# EAGLE schematic RPiSoC_Shield (EAGLE 7.1.0)
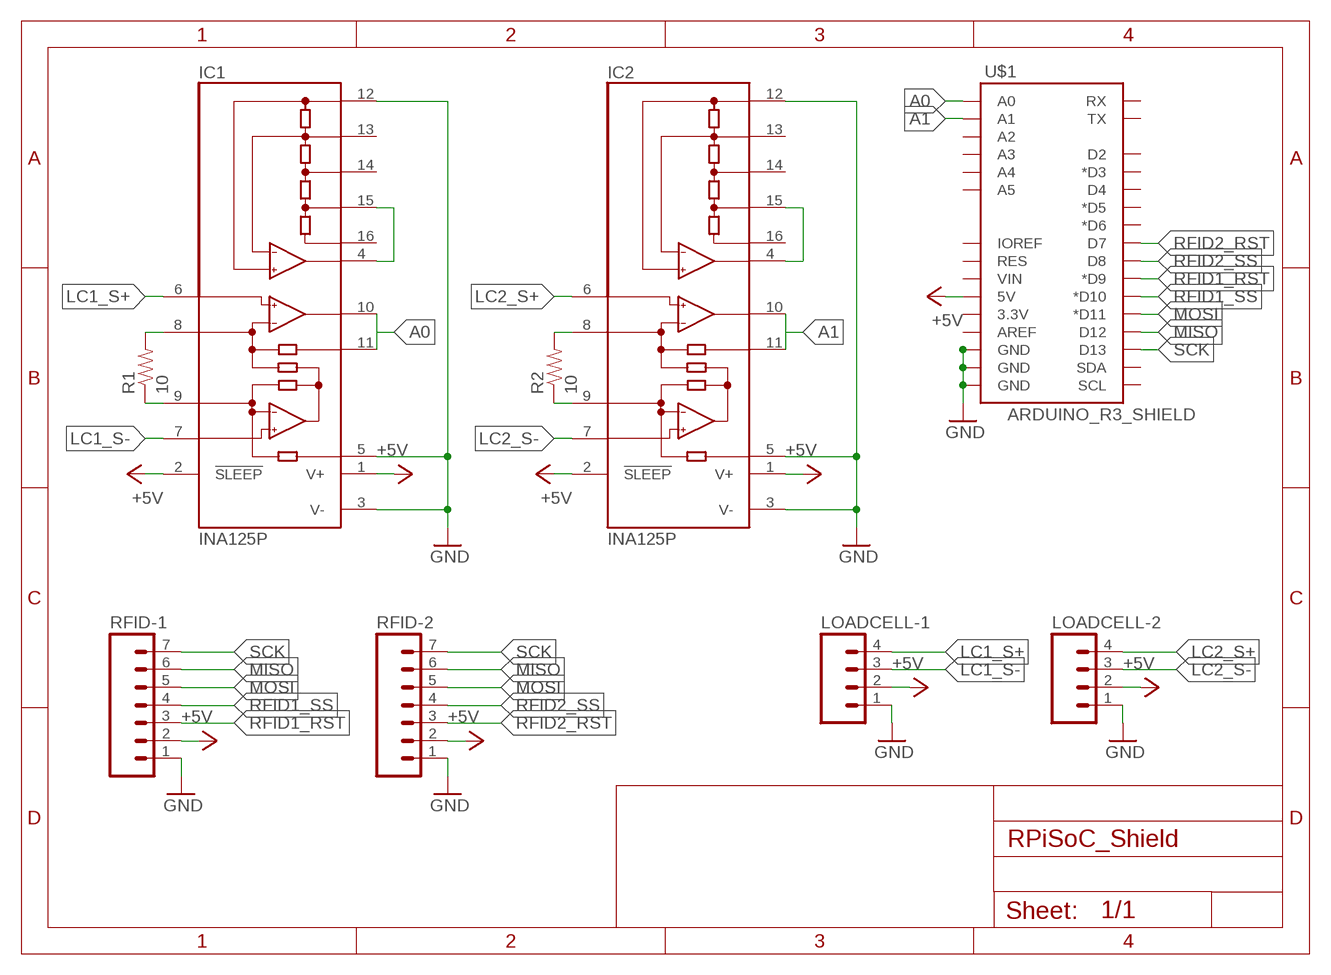
[diagram p0: schematic, sheet 1]
FRAME2 (DINA5_L): CNAME: [CaTS]; CREVISION: 0.1; DESIGNER: Frederick Vandenbosch

## Parts
IC1  INA125P  [DIL16]
IC2  INA125P  [DIL16]
LOADCELL-1  M04PTH  [1X04]
LOADCELL-2  M04PTH  [1X04]
R1  10  RESISTOREZ  [AXIAL-0.3EZ]
R2  10  RESISTOREZ  [AXIAL-0.3EZ]
RFID-1  M07  [1X07]
RFID-2  M07  [1X07]
U$1  ARDUINO_R3_SHIELD  [UNO_R3_SHIELD]

## Nets
+5V: IC1.1(V+) IC1.2(!SLEEP) IC2.1(V+) IC2.2(!SLEEP) LOADCELL-1.2 LOADCELL-2.2 RFID-1.2 RFID-2.2 U$1.5V
A0: IC1.10(OUT) IC1.11(SENSE) U$1.A0
A1: IC2.10(OUT) IC2.11(SENSE) U$1.A1
GND: IC1.3(V-) IC1.5(REF) IC1.12(REFCOM) IC2.3(V-) IC2.5(REF) IC2.12(REFCOM) LOADCELL-1.1 LOADCELL-2.1 RFID-1.1 RFID-2.1 U$1.GND@0(GND) U$1.GND@1(GND) U$1.GND@2(GND)
LC1_S+: IC1.6(+IN) LOADCELL-1.4
LC1_S-: IC1.7(-IN) LOADCELL-1.3
LC2_S+: IC2.6(+IN) LOADCELL-2.4
LC2_S-: IC2.7(-IN) LOADCELL-2.3
MISO: RFID-1.6 RFID-2.6 U$1.D12
MOSI: RFID-1.5 RFID-2.5 U$1.D11(*D11)
N$1: IC2.8(RG) R2.P$2
N$2: IC2.9(RG) R2.P$1
N$3: IC1.8(RG) R1.P$2
N$4: IC1.9(RG) R1.P$1
N$6: IC2.4(REFOUT) IC2.15(REF5)
N$9: IC1.4(REFOUT) IC1.15(REF5)
RFID1_RST: RFID-1.3 U$1.D9(*D9)
RFID1_SS: RFID-1.4 U$1.D10(*D10)
RFID2_RST: RFID-2.3 U$1.D7
RFID2_SS: RFID-2.4 U$1.D8
SCK: RFID-1.7 RFID-2.7 U$1.D13
Unconnected: IC1.13(REFBG) IC1.14(REF2.5) IC1.16(REF10) IC2.13(REFBG) IC2.14(REF2.5) IC2.16(REF10) U$1.3.3V U$1.A2 U$1.A3 U$1.A4 U$1.A5 U$1.AREF U$1.D2 U$1.D3(*D3) U$1.D4 U$1.D5(*D5) U$1.D6(*D6) U$1.IOREF U$1.RES U$1.RX U$1.SCL U$1.SDA U$1.TX U$1.VIN

## Library data of the parts
IC1 IC2 = burr-brown:INA125: Instrumentation Amplifier with Precision Voltage Reference; MF: TEXAS INSTRUMENT CONNECTORS; MPN: INA125P; OC_FARNELL: 1459461; OC_NEWARK: 35C1726
LOADCELL-1 LOADCELL-2 = SparkFun-Connectors:M04: Header 4 Standard 4-pin 0.1" header. Use with straight break away headers (SKU : PRT-00116), right angle break away headers (PRT-00553), swiss pins (PRT-00743), machine pins (PRT-00117), and female headers (PRT-00115). Molex polarized connector foot print use with SKU : PRT-08231 with associated crimp pins and housings. 1MM SMD Version SKU: PRT-10208
R1 R2 = SparkFun-Resistors:RESISTOR: Resistor Basic schematic elements and footprints for 0603, 1206, and PTH resistors.
RFID-1 RFID-2 = SparkFun-Connectors:M07: Header 7 Standard 7-pin 0.1" header. Use with straight break away headers (SKU : PRT-00116), right angle break away headers (PRT-00553), swiss pins (PRT-00743), machine pins (PRT-00117), and female headers (PRT-00115). NOTES ON THE VARIANTS LOCK and LOCK_LONGPADS... This footprint was designed to help hold the alignment of a through-hole component (i.e. 7-pin header) while soldering it into place. You may notice that each hole has been shifted either up or down by 0.005 of an inch from it's more standard position (which is usually a perfectly straight line). This slight alteration caused the pins (the squares in the middle) to touch the edges of the holes. Because they are alternating, it causes a "brace" to hold the header in place. 0.005 has proven to be the perfect amount of "off-center" position when using our standard breakaway headers. Although looks a little odd when you look at the bare footprint, once you have a header in there, the alteration is very hard to notice. Also, if you push a header all the way into place, it is covered up entirely on the bottom side. This idea of altering the position of holes to aid alignment will be further integrated into the Sparkfun Library for other footprints. It can help hold any component with 3 or more connection pins.
U$1 = SparkFun-Boards:ARDUINO_R3_SHIELD: Shield form compatible with the Arduino Uno R3.